# Altium schematic sheet POWER MANAGEMENT.SchDoc
size A4
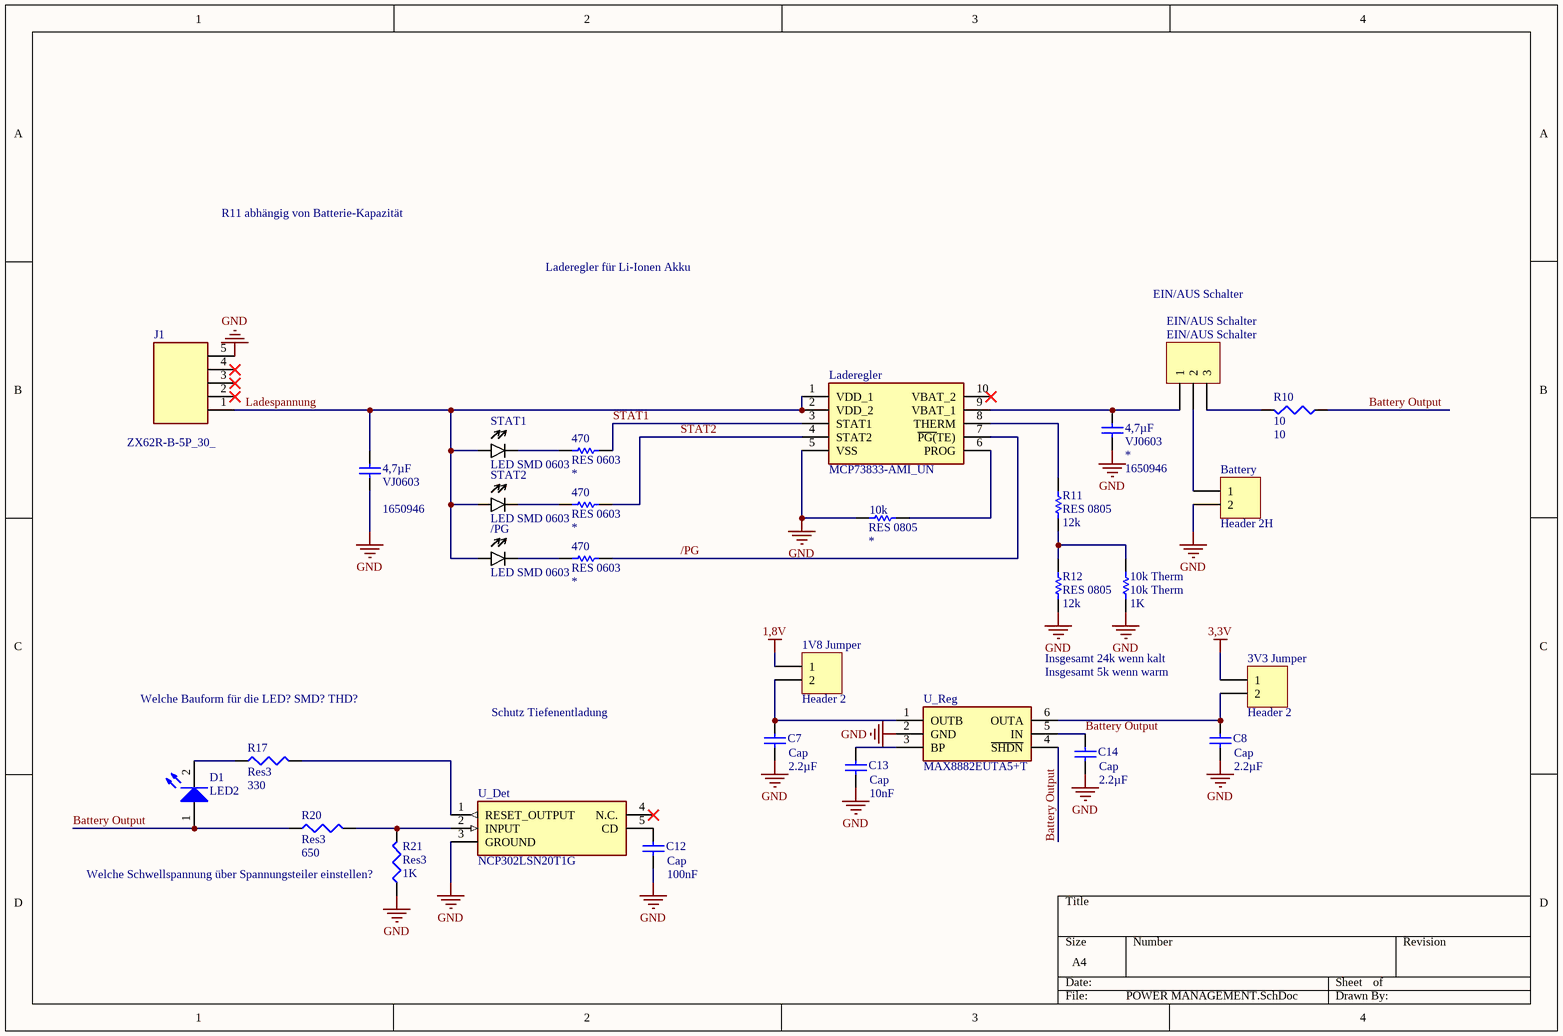
[diagram p0: POWER MANAGEMENT.SchDoc]

## Parts
(Parts that share a designator on the sheet are numbered #1, #2 ... from top to bottom, then left to right.)
1V8_Jumper  Header 2  [HDR1X2]
3V3_Jumper  Header 2  [HDR1X2]
4,7µF#1  VJ0603  Supplier Part Number 1: 1650946  [VJ0603]
4,7µF#2  VJ0603  Supplier Part Number 1: 1650946  [VJ0603]
10k  RES 0805  [D12CRCW0805]
10k_Therm  10k Therm  value 1K  [6-0805_M]
470#1  RES 0603  [Vishay D11/CRCW0603 Resistor]
470#2  RES 0603  [Vishay D11/CRCW0603 Resistor]
470#3  RES 0603  [Vishay D11/CRCW0603 Resistor]
/PG  LED SMD 0603  [SMD LED 0603]
Battery  Header 2H  [JST-PH 2-Pin 2.0mm]
C7  Cap  value 2.2µF  [1608[0603]]
C8  Cap  value 2.2µF  [1608[0603]]
C12  Cap  value 100nF  [1608[0603]]
C13  Cap  value 10nF  [1608[0603]]
C14  Cap  value 2.2µF  [1608[0603]]
D1  LED2  [HDR1X2]
EIN/AUS_Schalter  EIN/AUS Schalter  [HDR1X3]
J1  ZX62R-B-5P_30_  [ZX62R-B-5P(30)]
Laderegler  MCP73833-AMI_UN  [SOP50P490X110-10N]
R10  10  [J1-0603]
R11  RES 0805  value 12k  [D12CRCW0805]
R12  RES 0805  value 12k  [D12CRCW0805]
R17  Res3  value 330  [J1-0603]
R20  Res3  value 650  [J1-0603]
R21  Res3  value 1K  [J1-0603]
STAT1  LED SMD 0603  [SMD LED 0603]
STAT2  LED SMD 0603  [SMD LED 0603]
U_Det  NCP302LSN20T1G  [SOT95P275X110-5N]
U_Reg  MAX8882EUTA5+T  [SOT95P280X145-6N]

## Nets
1,8V: 1V8_Jumper.1
3,3V: 3V3_Jumper.1
GND: 4,7µF#1.2 4,7µF#2.2 10k.1 10k_Therm.1 Battery.2 C7.1 C8.1 C12.1 C13.1 C14.1 J1.5 Laderegler.5(VSS) R12.1 R21.1 U_Det.3(GROUND) U_Reg.2(GND)
/PG: 470#3.2 Laderegler.7(~{PG(}TE))
Battery Output: C14.2 D1.1(A) R10.1 R20.1 U_Reg.4(~{SHDN}) U_Reg.5(IN)
Ladespannung: 4,7µF#2.1 /PG.1 J1.1 Laderegler.1(VDD_1) Laderegler.2(VDD_2) STAT1.1 STAT2.1
STAT1: 470#1.2 Laderegler.3(STAT1)
STAT2: 470#2.2 Laderegler.4(STAT2)
Net1V8_Jumper_2: 1V8_Jumper.2 C7.2 U_Reg.1(OUTB)
Net3V3_Jumper_2: 3V3_Jumper.2 C8.2 U_Reg.6(OUTA)
Net4,7µF#1_1: 4,7µF#1.1 EIN/AUS_Schalter.1 Laderegler.9(VBAT_1)
Net10k_2: 10k.2 Laderegler.6(PROG)
Net10k_Therm_2: 10k_Therm.2 R11.1 R12.2
Net470#1_1: 470#1.1 STAT1.2
Net470#2_1: 470#2.1 STAT2.2
Net470#3_1: 470#3.1 /PG.2
NetBattery_1: Battery.1 EIN/AUS_Schalter.2
NetC12_2: C12.2 U_Det.5(CD)
NetC13_2: C13.2 U_Reg.3(BP)
NetD1_2: D1.2(K) R17.1
NetEIN/AUS_Schalter_3: EIN/AUS_Schalter.3 R10.2
NetLaderegler_8: Laderegler.8(THERM) R11.2
NetR17_2: R17.2 U_Det.1(RESET_OUTPUT)
NetR20_2: R20.2 R21.2 U_Det.2(INPUT)

Not connected (* = marked no-connect by the designer): J1 2* 3* 4*; Laderegler 10(VBAT_2)*; U_Det 4(N.C.)*

## Notes on the sheet
- R11 abhängig von Batterie-Kapazität
- Laderegler für Li-Ionen Akku
- EIN/AUS Schalter
- Welche Bauform für die LED? SMD? THD?
- Schutz Tiefenentladung
- Insgesamt 24k wenn kalt
- Insgesamt 5k wenn warm
- (near R21) Welche Schwellspannung über Spannungsteiler einstellen?

## Library data of the parts
1V8_Jumper 3V3_Jumper = Header 2: Header, 2-Pin; LatestRevisionDate: 17-Jul-2002; LatestRevisionNote: Re-released for DXP Platform.; Publisher: Altium Limited
4,7µF#1 4,7µF#2 = VJ0603: Ceramic Chip Capacitor Vishay Vitramon; Supplier 1: Farnell
  4,7µF#1: Value: *
10k R11 R12 = RES 0805: Chip Resistor 0805; Fitted: False; Supplier 1: Farnell; Supplier Part Number 1: 1738935
  10k: Value: *
10k_Therm = Res1: Resistor; Published: 8-Jun-2000; LatestRevisionDate: 17-Jul-2002; LatestRevisionNote: Re-released for DXP Platform.; PackageReference: AXIAL-0.3; Publisher: Altium Limited; PackageDescription: Axial Device, Thru-Hole; 2 Leads; 0.3 in Pin Spacing
470#1-470#3 = RES 0603: Chip Resistor 0603; Fitted: False; Supplier 1: Farnell; Supplier Part Number 1: 1738901RL; Value: *
Battery = Header 2H: Header, 2-Pin, Right Angle; LatestRevisionDate: 17-Jul-2002; LatestRevisionNote: Re-released for DXP Platform.; Publisher: Altium Limited
C7 C8 C12-C14 = Cap: Capacitor; Published: 8-Jun-2000; LatestRevisionDate: 17-Jul-2002; LatestRevisionNote: Re-released for DXP Platform.; PackageReference: RAD-0.3; Publisher: Altium Limited; PackageDescription: Radial Cap, Thru-Hole; 2 Leads; 0.3 in Pin Spacing
D1 = LED2: Typical RED, GREEN, YELLOW, AMBER GaAs LED; Published: 8-Jun-2000; LatestRevisionDate: 17-Jul-2002; LatestRevisionNote: Re-released for DXP Platform.; PackageVersion: Feb-2002; PackageReference: 3.2X1.6X1.1; Publisher: Altium Limited; PackageDescription: SM LED; 2 Flat Leads
EIN/AUS_Schalter = Header 3H: Header, 3-Pin, Right Angle; LatestRevisionDate: 17-Jul-2002; LatestRevisionNote: Re-released for DXP Platform.; Publisher: Altium Limited
J1 = ZX62R-B-5P_30_: Connector; Manufacturer_Name: Hirose; Manufacturer_Part_Number: ZX62R-B-5P(30)
Laderegler = MCP73833-AMI_UN: Integrated Circuit; Manufacturer_Name: Microchip; Manufacturer_Part_Number: MCP73833-AMI/UN; Datasheet Link: https://componentsearchengine.com//MCP73833-AMI_UN.pdf; Height: 1.1mm; Mouser2 Part Number: 579-MCP73833-AMI/UN; Mouser2 Price/Stock: https://www.mouser.com/Search/Refine.aspx?Keyword=579-MCP73833-AMI%2FUN
R10 R17 R20 R21 = Res3: Resistor; Published: 8-Jun-2000; LatestRevisionDate: 29-May-2009; LatestRevisionNote: IPC-7351 Footprint Added.; PackageReference: J1-0603; Publisher: Altium Limited; PackageDescription: Chip Resistor
  R10: Value: 10
U_Det = NCP302LSN20T1G: Integrated Circuit; Manufacturer_Name: ON Semiconductor; Datasheet Link: http://www.onsemi.com/pub/Collateral/NCP302-D.PDF; Height: 1.1mm; Manufacturer_Part_Number: NCP302LSN20T1G
U_Reg = MAX8882EUTA5+T: Integrated Circuit; Manufacturer_Name: Maxim Integrated; Datasheet Link: https://pdfserv.maximintegrated.com/en/ds/MAX8882-MAX8883.pdf; Height: 1.45mm; Manufacturer_Part_Number: MAX8882EUTA5+T